# Altium project Enigma Rev A.PrjPCB (part 2 of 10)

## Sheet Snickerdoodle FPGA JA.SchDoc: Snickerdoodle JA
size Tabloid; ApprovedBy: NA; CompanyName: Cospan Design LLC; DrawnBy: Dave McCoy; Engineer: Dave McCoy; DocumentNumber: 4; Revision: A; SheetNumber: 4; SheetTotal: 20; Client: Public; Project: Enigma; ProjectPrettyName: Enigma
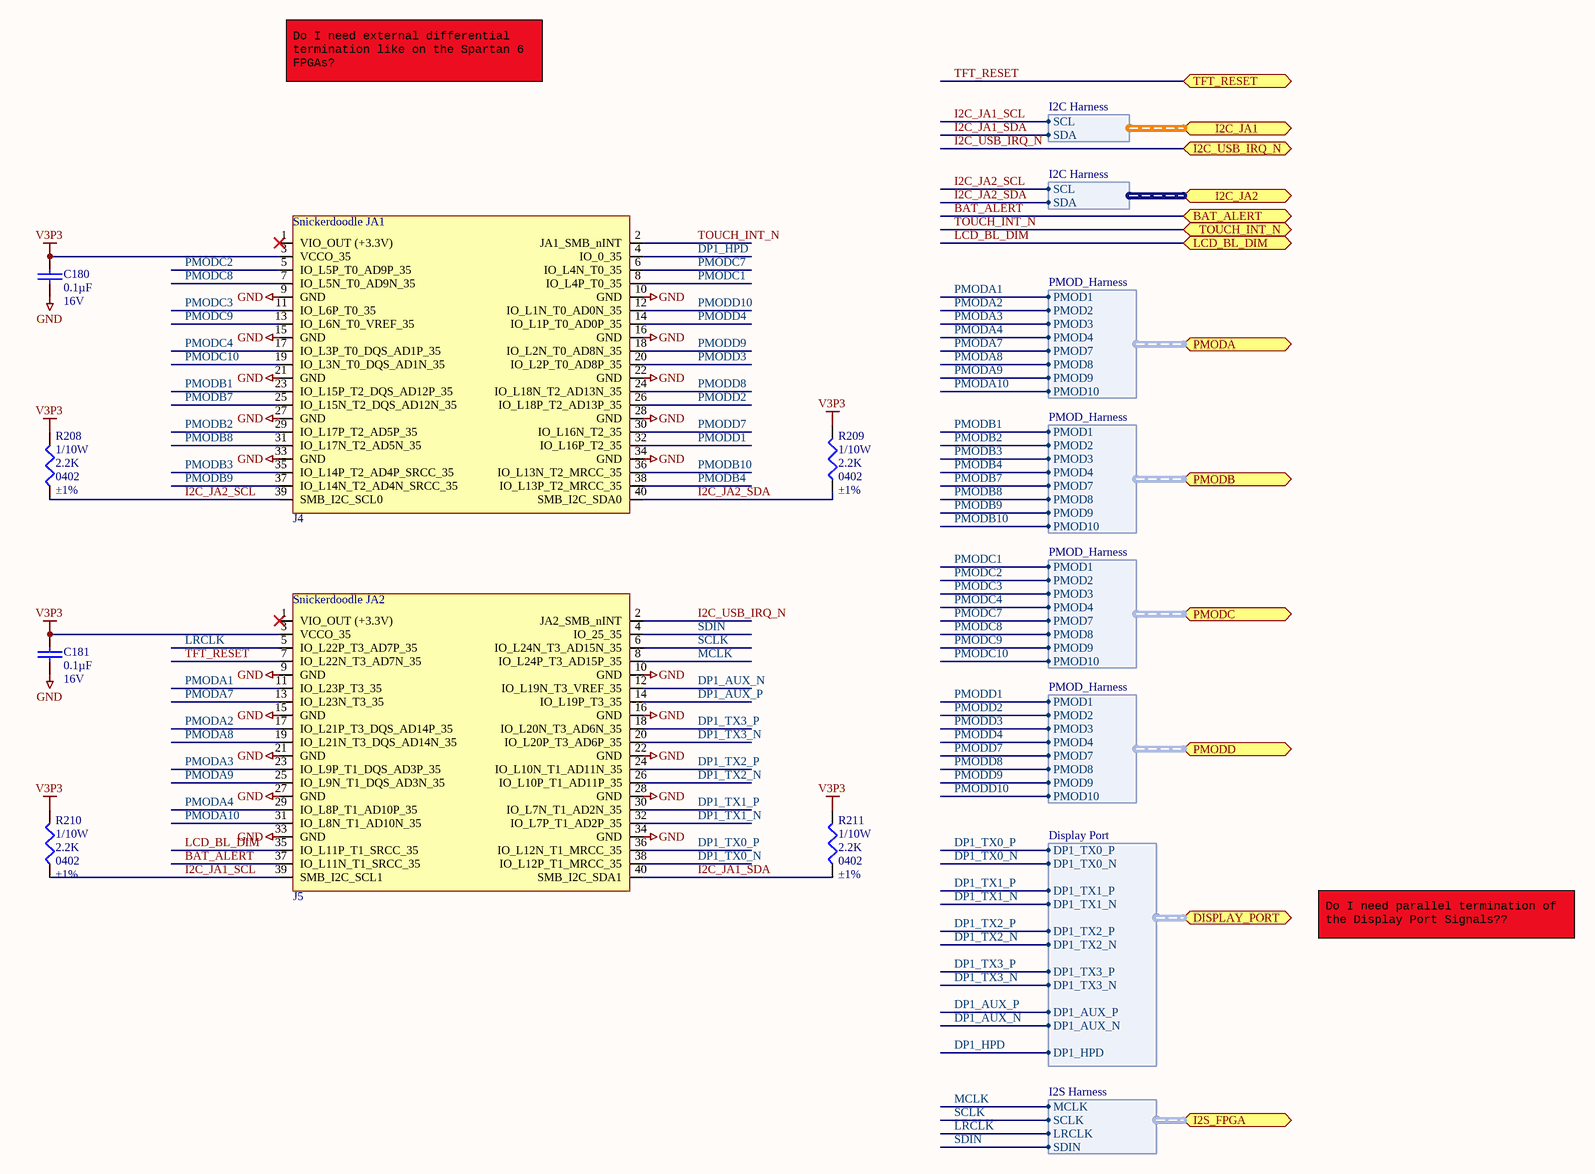
[diagram p5: Snickerdoodle FPGA JA.SchDoc]

### Parts
C180  Capacitance: 0.1µF  Voltage - Rated: 16V  [C_0402]  (hidden comment: 0.1uF)
C181  Capacitance: 0.1µF  Voltage - Rated: 16V  [C_0402]  (hidden comment: 0.1uF)
J4  J_SNICKERDOODLE_JA1  [TFM12001-X-D-A]  (value not drawn)
J5  J_SNICKERDOODLE_JA2  [TFM12001-X-D-A]  (value not drawn)
R208  Power (Watts): 1/10W  Resistance In Ohms: 2.2K  Case: 0402  Tolerance: ±1%  [R_0402]  (hidden comment: 2.2k Ohms)
R209  Power (Watts): 1/10W  Resistance In Ohms: 2.2K  Case: 0402  Tolerance: ±1%  [R_0402]  (hidden comment: 2.2k Ohms)
R210  Power (Watts): 1/10W  Resistance In Ohms: 2.2K  Case: 0402  Tolerance: ±1%  [R_0402]  (hidden comment: 2.2k Ohms)
R211  Power (Watts): 1/10W  Resistance In Ohms: 2.2K  Case: 0402  Tolerance: ±1%  [R_0402]  (hidden comment: 2.2k Ohms)

### Ports
BAT_ALERT, DISPLAY_PORT (harness Display Port), I2C_JA1 (harness I2C Harness), I2C_JA2 (harness I2C Harness), I2C_USB_IRQ_N, I2S_FPGA (harness I2S Harness), LCD_BL_DIM, PMODA (harness PMOD_Harness), PMODB (harness PMOD_Harness), PMODC (harness PMOD_Harness), PMODD (harness PMOD_Harness), TFT_RESET, TOUCH_INT_N

### Harnesses
I2C Harness: SCL, SDA
PMOD_Harness: PMOD1, PMOD2, PMOD3, PMOD4, PMOD7, PMOD8, PMOD9, PMOD10
Display Port: DP1_TX3_P, DP1_TX3_N, DP1_TX2_P, DP1_TX2_N, DP1_TX1_P, DP1_TX1_N, DP1_TX0_P, DP1_TX0_N, DP1_AUX_P, DP1_AUX_N, DP1_HPD
I2S Harness: MCLK, SCLK, LRCLK, SDIN

### Nets
GND: C180.1 C181.1 J4.9(GND) J4.10(GND) J4.15(GND) J4.16(GND) J4.21(GND) J4.22(GND) J4.27(GND) J4.28(GND) J4.33(GND) J4.34(GND) J5.9(GND) J5.10(GND) J5.15(GND) J5.16(GND) J5.21(GND) J5.22(GND) J5.27(GND) J5.28(GND) J5.33(GND) J5.34(GND)
V3P3: C180.2 C181.2 J4.3(VCCO_35) J5.3(VCCO_35) R208.1 R209.1 R210.1 R211.1
BAT_ALERT: J5.37(IO_L11N_T1_SRCC_35) ; port BAT_ALERT  [project net ALERT]
DP1_AUX_N: J5.12(IO_L19N_T3_VREF_35) ; port DISPLAY_PORT.DP1_AUX_N  [project net AUX_N]
DP1_AUX_P: J5.14(IO_L19P_T3_35) ; port DISPLAY_PORT.DP1_AUX_P  [project net AUX_P]
DP1_HPD: J4.4(IO_0_35) ; port DISPLAY_PORT.DP1_HPD  [project net DP_HPD]
DP1_TX0_N: J5.38(IO_L12P_T1_MRCC_35) ; port DISPLAY_PORT.DP1_TX0_N
DP1_TX0_P: J5.36(IO_L12N_T1_MRCC_35) ; port DISPLAY_PORT.DP1_TX0_P
DP1_TX1_N: J5.32(IO_L7P_T1_AD2P_35) ; port DISPLAY_PORT.DP1_TX1_N
DP1_TX1_P: J5.30(IO_L7N_T1_AD2N_35) ; port DISPLAY_PORT.DP1_TX1_P
DP1_TX2_N: J5.26(IO_L10P_T1_AD11P_35) ; port DISPLAY_PORT.DP1_TX2_N
DP1_TX2_P: J5.24(IO_L10N_T1_AD11N_35) ; port DISPLAY_PORT.DP1_TX2_P
DP1_TX3_N: J5.20(IO_L20P_T3_AD6P_35) ; port DISPLAY_PORT.DP1_TX3_N
DP1_TX3_P: J5.18(IO_L20N_T3_AD6N_35) ; port DISPLAY_PORT.DP1_TX3_P
I2C_JA1_SCL: J5.39(SMB_I2C_SCL1) R210.2 ; port I2C_JA1.SCL  [project net I2C_USB_SCL]
I2C_JA1_SDA: J5.40(SMB_I2C_SDA1) R211.2 ; port I2C_JA1.SDA  [project net I2C_USB_SDA]
I2C_JA2_SCL: J4.39(SMB_I2C_SCL0) R208.2 ; port I2C_JA2.SCL  [project net TOUCH_SCL]
I2C_JA2_SDA: J4.40(SMB_I2C_SDA0) R209.2 ; port I2C_JA2.SDA  [project net TOUCH_SDA]
I2C_USB_IRQ_N: J5.2(JA2_SMB_nINT) ; port I2C_USB_IRQ_N
LCD_BL_DIM: J5.35(IO_L11P_T1_SRCC_35) ; port LCD_BL_DIM
LRCLK: J5.5(IO_L22P_T3_AD7P_35) ; port I2S_FPGA.LRCLK
MCLK: J5.8(IO_L24P_T3_AD15P_35) ; port I2S_FPGA.MCLK
PMODA1: J5.11(IO_L23P_T3_35) ; port PMODA.PMOD1
PMODA2: J5.17(IO_L21P_T3_DQS_AD14P_35) ; port PMODA.PMOD2
PMODA3: J5.23(IO_L9P_T1_DQS_AD3P_35) ; port PMODA.PMOD3
PMODA4: J5.29(IO_L8P_T1_AD10P_35) ; port PMODA.PMOD4
PMODA7: J5.13(IO_L23N_T3_35) ; port PMODA.PMOD7
PMODA8: J5.19(IO_L21N_T3_DQS_AD14N_35) ; port PMODA.PMOD8
PMODA9: J5.25(IO_L9N_T1_DQS_AD3N_35) ; port PMODA.PMOD9
PMODA10: J5.31(IO_L8N_T1_AD10N_35) ; port PMODA.PMOD10
PMODB1: J4.23(IO_L15P_T2_DQS_AD12P_35) ; port PMODB.PMOD1
PMODB2: J4.29(IO_L17P_T2_AD5P_35) ; port PMODB.PMOD2
PMODB3: J4.35(IO_L14P_T2_AD4P_SRCC_35) ; port PMODB.PMOD3
PMODB4: J4.38(IO_L13P_T2_MRCC_35) ; port PMODB.PMOD4
PMODB7: J4.25(IO_L15N_T2_DQS_AD12N_35) ; port PMODB.PMOD7
PMODB8: J4.31(IO_L17N_T2_AD5N_35) ; port PMODB.PMOD8
PMODB9: J4.37(IO_L14N_T2_AD4N_SRCC_35) ; port PMODB.PMOD9
PMODB10: J4.36(IO_L13N_T2_MRCC_35) ; port PMODB.PMOD10
PMODC1: J4.8(IO_L4P_T0_35) ; port PMODC.PMOD1
PMODC2: J4.5(IO_L5P_T0_AD9P_35) ; port PMODC.PMOD2
PMODC3: J4.11(IO_L6P_T0_35) ; port PMODC.PMOD3
PMODC4: J4.17(IO_L3P_T0_DQS_AD1P_35) ; port PMODC.PMOD4
PMODC7: J4.6(IO_L4N_T0_35) ; port PMODC.PMOD7
PMODC8: J4.7(IO_L5N_T0_AD9N_35) ; port PMODC.PMOD8
PMODC9: J4.13(IO_L6N_T0_VREF_35) ; port PMODC.PMOD9
PMODC10: J4.19(IO_L3N_T0_DQS_AD1N_35) ; port PMODC.PMOD10
PMODD1: J4.32(IO_L16P_T2_35) ; port PMODD.PMOD1
PMODD2: J4.26(IO_L18P_T2_AD13P_35) ; port PMODD.PMOD2
PMODD3: J4.20(IO_L2P_T0_AD8P_35) ; port PMODD.PMOD3
PMODD4: J4.14(IO_L1P_T0_AD0P_35) ; port PMODD.PMOD4
PMODD7: J4.30(IO_L16N_T2_35) ; port PMODD.PMOD7
PMODD8: J4.24(IO_L18N_T2_AD13N_35) ; port PMODD.PMOD8
PMODD9: J4.18(IO_L2N_T0_AD8N_35) ; port PMODD.PMOD9
PMODD10: J4.12(IO_L1N_T0_AD0N_35) ; port PMODD.PMOD10
SCLK: J5.6(IO_L24N_T3_AD15N_35) ; port I2S_FPGA.SCLK
SDIN: J5.4(IO_25_35) ; port I2S_FPGA.SDIN
TFT_RESET: J5.7(IO_L22N_T3_AD7N_35) ; port TFT_RESET
TOUCH_INT_N: J4.2(JA1_SMB_nINT) ; port TOUCH_INT_N

Not connected (* = marked no-connect by the designer): J4 1(VIO_OUT_(+3.3V))*; J5 1(VIO_OUT_(+3.3V))*

### Notes on the sheet
- Do I need external differential termination like on the Spartan 6 FPGAs?
- Do I need parallel termination of the Display Port Signals??
- Project:
- http://www.cospandesign.com
- Cospan Design
- Document:
- Engineer:
- Title:
- Client:
- Approved By:
- Revision:
- Date:
- Number:
- of
- (in symbol J_SNICKERDOODLE_JA1) Snickerdoodle JA1
- (in symbol J_SNICKERDOODLE_JA2) Snickerdoodle JA2

### Library data of the parts
C180 C181 = C_0402_0.1UF_16V: CAP CER .10UF 16V X7R 0402; Manufacturer: TDK Corporation; Manufacturer Part Number: C1005X7R1C104K050BC; Tolerance: ±10%; Supplier 1: Digi-Key; RoHS: RoHS Compliant; Category: Capacitors; Stock 1: 2696686; Pricing 1: 1=0.1, 10=0.05, 100=0.0231, 250=0.01892, 500=0.01618, 1000=0.0126, 5000=0.0105 (USD); Packaging: Cut Tape (CT); Part Status: Not For New Designs; Operating Temperature: -55°C ~ 125°C; Features: Low ESL; Ratings: -; Applications: General Purpose; Failure Rate: -; Mounting Type: Surface Mount, MLCC; Size / Dimension: 0.039" L x 0.020" W (1.00mm x 0.50mm); Height - Seated (Max): -; Thickness (Max): 0.022" (0.55mm); Lead Spacing: -; Lead Style: -; ComponentLink1URL: https://product.tdk.com/info/en/catalog/datasheets/mlcc_commercial_general_en.pdf; ComponentLink1Description: https://product.tdk.com/info/en/catalog/datasheets/mlcc_commercial_general_en.pdf; Supplier Part Number 1: 445-4952-1-ND; Temperature Coefficient: X7R; Package / Case: 0402
R208-R211 = R_0402_2.2K: as R219 on sheet Snickerdoodle PS; Supplier 1: Digi-Key; Supplier Part Number 1: 311-2.20KLRCT-ND; RoHS: RoHS Compliant; Category: Resistors; Stock 1: 0; Pricing: 10=0.014, 100=0.0063, 500=0.00382, 1000=0.0027, 5000=0.00203 (USD); Resistance (Ohms): 2.2K; Composition: Thick Film; Features: -; Package / Case: 0402 (1005 Metric); Size / Dimension: 0.039" L x 0.020" W (1.00mm x 0.50mm); Height: 0.016" (0.40mm); Number of Terminations: 2; Packaging: Cut Tape (CT); ComponentLink1URL: http://www.yageo.com/documents/recent/PYu-RC0402_51_RoHS_L_6.pdf; ComponentLink1Description: http://www.yageo.com/documents/recent/PYu-RC0402_51_RoHS_L_6.pdf; Supplier 2: Digi-Key; Supplier Part Number 2: RMCF0402FT2K20CT-ND; Stock 2: 39712; ComponentLink2URL: http://www.seielect.com/Catalog/SEI-RMCF_RMCP.pdf; ComponentLink2Description: http://www.seielect.com/Catalog/SEI-RMCF_RMCP.pdf

## Sheet Snickerdoodle FPGA JB.SchDoc: Snickerdoodle JB
size Tabloid; ApprovedBy: NA; CompanyName: Cospan Design LLC; DrawnBy: Dave McCoy; Engineer: Dave McCoy; DocumentNumber: 5; Revision: A; SheetNumber: 5; SheetTotal: 20; Client: Public; Project: Enigma; ProjectPrettyName: Enigma
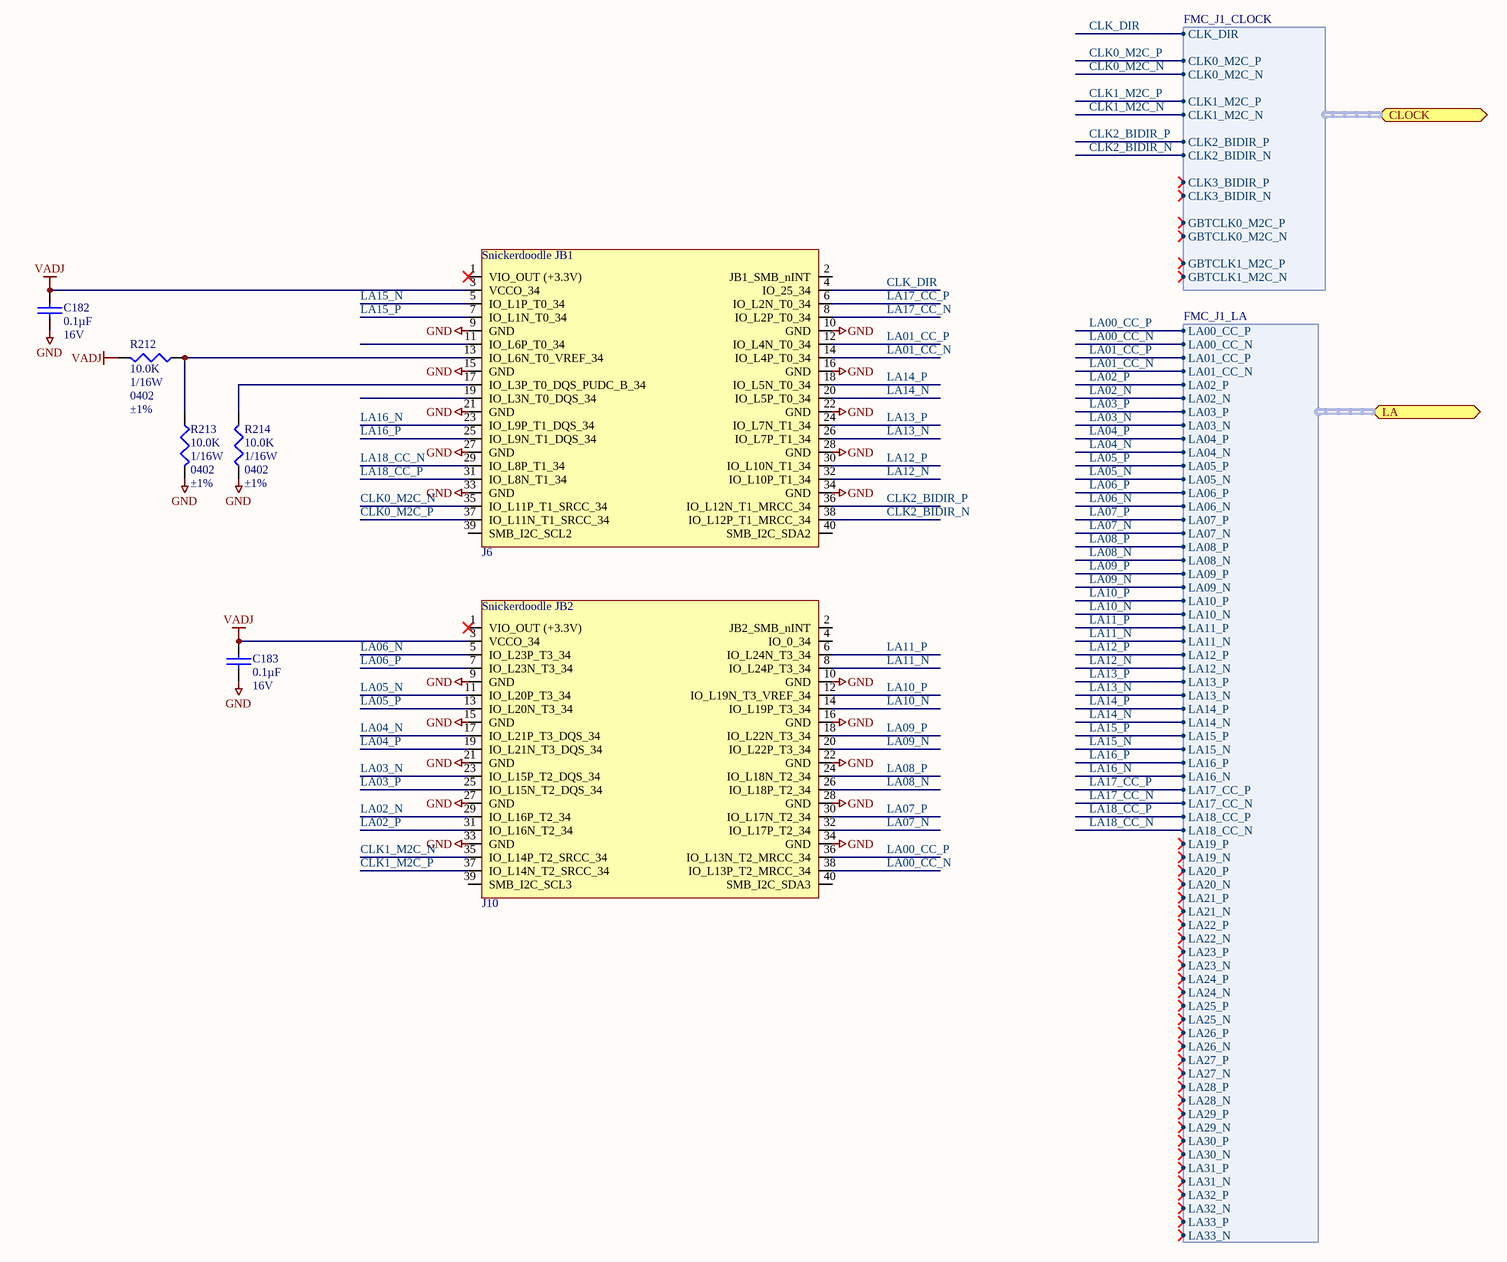
[diagram p6: Snickerdoodle FPGA JB.SchDoc]

### Parts
C182  Capacitance: 0.1µF  Voltage - Rated: 16V  [C_0402]  (hidden comment: 0.1uF)
C183  Capacitance: 0.1µF  Voltage - Rated: 16V  [C_0402]  (hidden comment: 0.1uF)
J6  J_SNICKERDOODLE_JB1  [TFM12001-X-D-A]  (value not drawn)
J10  J_SNICKERDOODLE_JB2  [TFM12001-X-D-A]  (value not drawn)
R212  Resistance In Ohms: 10.0K  Power (Watts): 1/16W  Case: 0402  Tolerance: ±1%  [R_0402]  (hidden comment: R_0402_10.0K)
R213  Resistance In Ohms: 10.0K  Power (Watts): 1/16W  Case: 0402  Tolerance: ±1%  [R_0402]  (hidden comment: R_0402_10.0K)
R214  Resistance In Ohms: 10.0K  Power (Watts): 1/16W  Case: 0402  Tolerance: ±1%  [R_0402]  (hidden comment: R_0402_10.0K)

### Ports
CLOCK (harness FMC_J1_CLOCK), LA (harness FMC_J1_LA)

### Harnesses
FMC_J1_CLOCK: CLK_DIR, CLK0_M2C_N, CLK0_M2C_P, CLK1_M2C_N, CLK1_M2C_P, CLK2_BIDIR_N, CLK2_BIDIR_P, CLK3_BIDIR_N, CLK3_BIDIR_P, GBTCLK0_M2C_N, GBTCLK0_M2C_P, GBTCLK1_M2C_N, GBTCLK1_M2C_P
FMC_J1_LA: LA00_CC_N, LA00_CC_P, LA01_CC_N, LA01_CC_P, LA02_N, LA02_P, LA03_N, LA03_P, LA04_N, LA04_P, LA05_N, LA05_P, LA06_N, LA06_P, LA07_N, LA07_P, LA08_N, LA08_P, LA09_N, LA09_P, LA10_N, LA10_P, LA11_N, LA11_P, LA12_N, LA12_P, LA13_N, LA13_P, LA14_N, LA14_P, LA15_N, LA15_P, LA16_N, LA16_P, LA17_CC_N, LA17_CC_P, LA18_CC_N, LA18_CC_P, LA19_N, LA19_P, LA20_N, LA20_P, LA21_N, LA21_P, LA22_N, LA22_P, LA23_N, LA23_P, LA24_N, LA24_P, LA25_N, LA25_P, LA26_N, LA26_P, LA27_N, LA27_P, LA28_N, LA28_P, LA29_N, LA29_P, LA30_N, LA30_P, LA31_N, LA31_P, LA32_N, LA32_P, LA33_N, LA33_P

### Nets
GND: C182.1 C183.1 J6.9(GND) J6.10(GND) J6.15(GND) J6.16(GND) J6.21(GND) J6.22(GND) J6.27(GND) J6.28(GND) J6.33(GND) J6.34(GND) J10.9(GND) J10.10(GND) J10.15(GND) J10.16(GND) J10.21(GND) J10.22(GND) J10.27(GND) J10.28(GND) J10.33(GND) J10.34(GND) R213.1 R214.2
VADJ: C182.2 C183.2 J6.3(VCCO_34) J10.3(VCCO_34) R212.1
CLK0_M2C_N: J6.35(IO_L11P_T1_SRCC_34) ; port CLOCK.CLK0_M2C_N
CLK0_M2C_P: J6.37(IO_L11N_T1_SRCC_34) ; port CLOCK.CLK0_M2C_P
CLK1_M2C_N: J10.35(IO_L14P_T2_SRCC_34) ; port CLOCK.CLK1_M2C_N
CLK1_M2C_P: J10.37(IO_L14N_T2_SRCC_34) ; port CLOCK.CLK1_M2C_P
CLK2_BIDIR_N: J6.38(IO_L12P_T1_MRCC_34) ; port CLOCK.CLK2_BIDIR_N
CLK2_BIDIR_P: J6.36(IO_L12N_T1_MRCC_34) ; port CLOCK.CLK2_BIDIR_P
CLK_DIR: J6.4(IO_25_34) ; port CLOCK.CLK_DIR
LA00_CC_N: J10.38(IO_L13P_T2_MRCC_34) ; port LA.LA00_CC_N
LA00_CC_P: J10.36(IO_L13N_T2_MRCC_34) ; port LA.LA00_CC_P
LA01_CC_N: J6.14(IO_L4P_T0_34) ; port LA.LA01_CC_N
LA01_CC_P: J6.12(IO_L4N_T0_34) ; port LA.LA01_CC_P
LA02_N: J10.29(IO_L16P_T2_34) ; port LA.LA02_N
LA02_P: J10.31(IO_L16N_T2_34) ; port LA.LA02_P
LA03_N: J10.23(IO_L15P_T2_DQS_34) ; port LA.LA03_N
LA03_P: J10.25(IO_L15N_T2_DQS_34) ; port LA.LA03_P
LA04_N: J10.17(IO_L21P_T3_DQS_34) ; port LA.LA04_N
LA04_P: J10.19(IO_L21N_T3_DQS_34) ; port LA.LA04_P
LA05_N: J10.11(IO_L20P_T3_34) ; port LA.LA05_N
LA05_P: J10.13(IO_L20N_T3_34) ; port LA.LA05_P
LA06_N: J10.5(IO_L23P_T3_34) ; port LA.LA06_N
LA06_P: J10.7(IO_L23N_T3_34) ; port LA.LA06_P
LA07_N: J10.32(IO_L17P_T2_34) ; port LA.LA07_N
LA07_P: J10.30(IO_L17N_T2_34) ; port LA.LA07_P
LA08_N: J10.26(IO_L18P_T2_34) ; port LA.LA08_N
LA08_P: J10.24(IO_L18N_T2_34) ; port LA.LA08_P
LA09_N: J10.20(IO_L22P_T3_34) ; port LA.LA09_N
LA09_P: J10.18(IO_L22N_T3_34) ; port LA.LA09_P
LA10_N: J10.14(IO_L19P_T3_34) ; port LA.LA10_N
LA10_P: J10.12(IO_L19N_T3_VREF_34) ; port LA.LA10_P
LA11_N: J10.8(IO_L24P_T3_34) ; port LA.LA11_N
LA11_P: J10.6(IO_L24N_T3_34) ; port LA.LA11_P
LA12_N: J6.32(IO_L10P_T1_34) ; port LA.LA12_N
LA12_P: J6.30(IO_L10N_T1_34) ; port LA.LA12_P
LA13_N: J6.26(IO_L7P_T1_34) ; port LA.LA13_N
LA13_P: J6.24(IO_L7N_T1_34) ; port LA.LA13_P
LA14_N: J6.20(IO_L5P_T0_34) ; port LA.LA14_N
LA14_P: J6.18(IO_L5N_T0_34) ; port LA.LA14_P
LA15_N: J6.5(IO_L1P_T0_34) ; port LA.LA15_N
LA15_P: J6.7(IO_L1N_T0_34) ; port LA.LA15_P
LA16_N: J6.23(IO_L9P_T1_DQS_34) ; port LA.LA16_N
LA16_P: J6.25(IO_L9N_T1_DQS_34) ; port LA.LA16_P
LA17_CC_N: J6.8(IO_L2P_T0_34) ; port LA.LA17_CC_N
LA17_CC_P: J6.6(IO_L2N_T0_34) ; port LA.LA17_CC_P
LA18_CC_N: J6.29(IO_L8P_T1_34) ; port LA.LA18_CC_N
LA18_CC_P: J6.31(IO_L8N_T1_34) ; port LA.LA18_CC_P
NetJ6_13: J6.13(IO_L6N_T0_VREF_34) R212.2 R213.2
NetJ6_17: J6.17(IO_L3P_T0_DQS_PUDC_B_34) R214.1

Not connected (* = marked no-connect by the designer): J6 1(VIO_OUT_(+3.3V))* 2(JB1_SMB_nINT) 11(IO_L6P_T0_34) 19(IO_L3N_T0_DQS_34) 39(SMB_I2C_SCL2) 40(SMB_I2C_SDA2); J10 1(VIO_OUT_(+3.3V))* 2(JB2_SMB_nINT) 4(IO_0_34) 39(SMB_I2C_SCL3) 40(SMB_I2C_SDA3)

### Notes on the sheet
- Project:
- http://www.cospandesign.com
- Cospan Design
- Document:
- Engineer:
- Title:
- Client:
- Approved By:
- Revision:
- Date:
- Number:
- of
- (in symbol J_SNICKERDOODLE_JB1) Snickerdoodle JB1
- (in symbol J_SNICKERDOODLE_JB2) Snickerdoodle JB2

### Library data of the parts
C182 C183 = C_0402_0.1UF_16V: as C180 on sheet Snickerdoodle FPGA JA; Supplier 1: Digi-Key; RoHS: RoHS Compliant; Category: Capacitors; Stock 1: 2696686; Pricing 1: 1=0.1, 10=0.05, 100=0.0231, 250=0.01892, 500=0.01618, 1000=0.0126, 5000=0.0105 (USD); Packaging: Cut Tape (CT); Part Status: Not For New Designs; Operating Temperature: -55°C ~ 125°C; Features: Low ESL; Ratings: -; Applications: General Purpose; Failure Rate: -; Mounting Type: Surface Mount, MLCC; Size / Dimension: 0.039" L x 0.020" W (1.00mm x 0.50mm); Height - Seated (Max): -; Thickness (Max): 0.022" (0.55mm); Lead Spacing: -; Lead Style: -; ComponentLink1URL: https://product.tdk.com/info/en/catalog/datasheets/mlcc_commercial_general_en.pdf; ComponentLink1Description: https://product.tdk.com/info/en/catalog/datasheets/mlcc_commercial_general_en.pdf; Supplier Part Number 1: 445-4952-1-ND; Temperature Coefficient: X7R; Package / Case: 0402
R212-R214 = R_0402_10.0K: as R1 on sheet Block Diagram; Supplier 1: Digi-Key; Supplier Part Number 1: RMCF0402FT10K0CT-ND; RoHS: RoHS Compliant; Category: Resistors; Stock 1: 234525; Pricing: 1=0.04, 10=0.025, 50=0.0138, 100=0.0105, 250=0.0078, 500=0.00576, 1000=0.00384, 2500=0.00324, 5000=0.0027 (USD); Composition: Thick Film; Features: -; Package / Case: 0402 (1005 Metric); Size / Dimension: 0.039" L x 0.020" W (1.00mm x 0.50mm); Height: 0.016" (0.40mm); Number of Terminations: 2; Packaging: Cut Tape (CT); ComponentLink1URL: http://www.seielect.com/Catalog/SEI-RMCF_RMCP.pdf; ComponentLink1Description: http://www.seielect.com/Catalog/SEI-RMCF_RMCP.pdf

## Sheet Snickerdoodle FPGA JC.SchDoc: Snickerdoodle JC
size Tabloid; ApprovedBy: NA; CompanyName: Cospan Design LLC; DrawnBy: Dave McCoy; Engineer: Dave McCoy; DocumentNumber: 7; Revision: A; SheetNumber: 7; SheetTotal: 20; Client: Public; Project: Enigma; ProjectPrettyName: Enigma
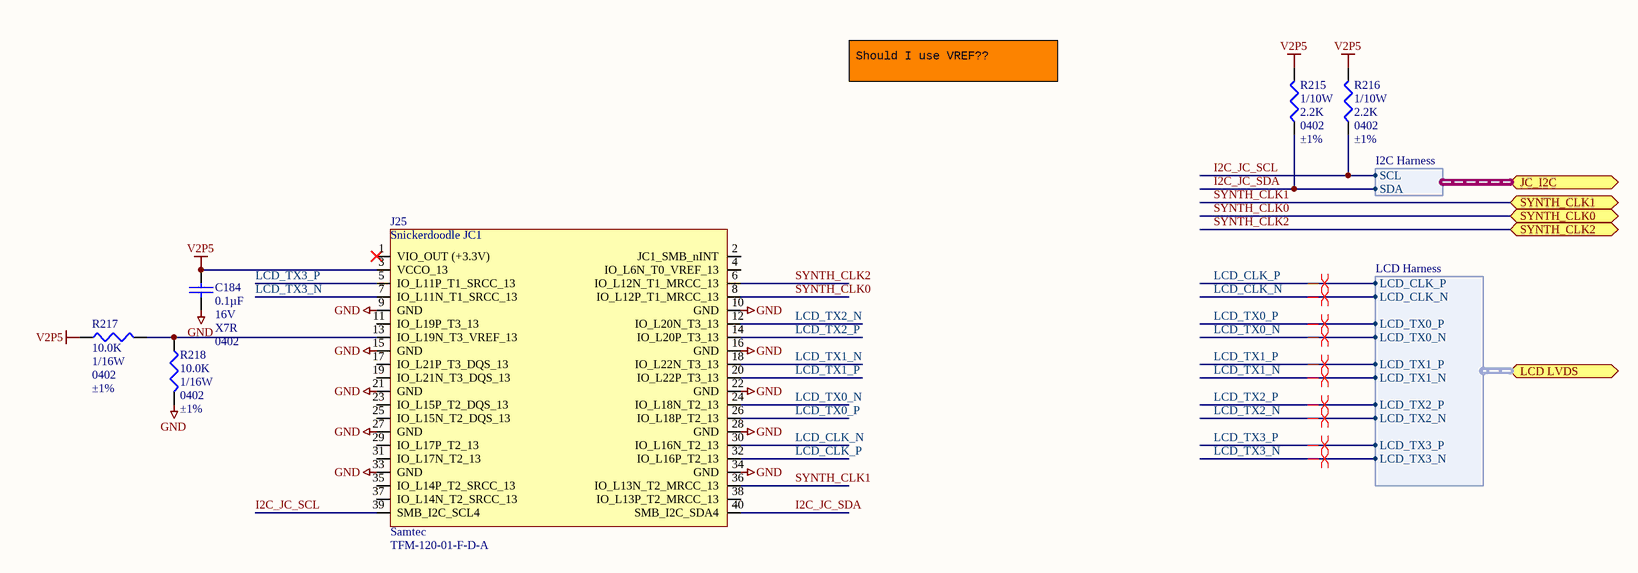
[diagram p7: Snickerdoodle FPGA JC.SchDoc]

### Parts
C184  Capacitance: 0.1µF  Voltage - Rated: 16V  Temperature Coefficient: X7R  Package / Case: 0402  [C_0402]  (hidden comment: 0.1uF)
J25  Manufacturer: Samtec  Manufacturer Part Number: TFM-120-01-F-D-A  [TFM12001-X-D-A]  (hidden comment: J_SNICKERDOODLE_JC1)
R215  Power (Watts): 1/10W  Resistance In Ohms: 2.2K  Case: 0402  Tolerance: ±1%  [R_0402]  (hidden comment: 2.2k Ohms)
R216  Power (Watts): 1/10W  Resistance In Ohms: 2.2K  Case: 0402  Tolerance: ±1%  [R_0402]  (hidden comment: 2.2k Ohms)
R217  Resistance In Ohms: 10.0K  Power (Watts): 1/16W  Case: 0402  Tolerance: ±1%  [R_0402]  (hidden comment: R_0402_10.0K)
R218  Resistance In Ohms: 10.0K  Power (Watts): 1/16W  Case: 0402  Tolerance: ±1%  [R_0402]  (hidden comment: R_0402_10.0K)

### Ports
JC_I2C (harness I2C Harness), LCD LVDS (harness LCD Harness), SYNTH_CLK0, SYNTH_CLK1, SYNTH_CLK2

### Harnesses
I2C Harness: SCL, SDA
LCD Harness: LCD_CLK_P, LCD_CLK_N, LCD_TX0_P, LCD_TX0_N, LCD_TX1_P, LCD_TX1_N, LCD_TX2_P, LCD_TX2_N, LCD_TX3_P, LCD_TX3_N

### Nets
GND: C184.1 J25.9(GND) J25.10(GND) J25.15(GND) J25.16(GND) J25.21(GND) J25.22(GND) J25.27(GND) J25.28(GND) J25.33(GND) J25.34(GND) R218.1
V2P5: C184.2 J25.3(VCCO_13) R215.1 R216.1 R217.2
I2C_JC_SCL: J25.39(SMB_I2C_SCL4) R216.2 ; port JC_I2C.SCL
I2C_JC_SDA: J25.40(SMB_I2C_SDA4) R215.2 ; port JC_I2C.SDA
LCD_CLK_N: J25.30(IO_L16N_T2_13) ; port LCD LVDS.LCD_CLK_N
LCD_CLK_P: J25.32(IO_L16P_T2_13) ; port LCD LVDS.LCD_CLK_P
LCD_TX0_N: J25.24(IO_L18N_T2_13) ; port LCD LVDS.LCD_TX0_N
LCD_TX0_P: J25.26(IO_L18P_T2_13) ; port LCD LVDS.LCD_TX0_P
LCD_TX1_N: J25.18(IO_L22N_T3_13) ; port LCD LVDS.LCD_TX1_N
LCD_TX1_P: J25.20(IO_L22P_T3_13) ; port LCD LVDS.LCD_TX1_P
LCD_TX2_N: J25.12(IO_L20N_T3_13) ; port LCD LVDS.LCD_TX2_N
LCD_TX2_P: J25.14(IO_L20P_T3_13) ; port LCD LVDS.LCD_TX2_P
LCD_TX3_N: J25.7(IO_L11N_T1_SRCC_13) ; port LCD LVDS.LCD_TX3_N
LCD_TX3_P: J25.5(IO_L11P_T1_SRCC_13) ; port LCD LVDS.LCD_TX3_P
SYNTH_CLK0: J25.8(IO_L12P_T1_MRCC_13) ; port SYNTH_CLK0
SYNTH_CLK1: J25.36(IO_L13N_T2_MRCC_13) ; port SYNTH_CLK1
SYNTH_CLK2: J25.6(IO_L12N_T1_MRCC_13) ; port SYNTH_CLK2
NetJ25_13: J25.13(IO_L19N_T3_VREF_13) R217.1 R218.2

Not connected (* = marked no-connect by the designer): J25 1(VIO_OUT_(+3.3V))* 2(JC1_SMB_nINT) 4(IO_L6N_T0_VREF_13) 11(IO_L19P_T3_13) 17(IO_L21P_T3_DQS_13) 19(IO_L21N_T3_DQS_13) 23(IO_L15P_T2_DQS_13) 25(IO_L15N_T2_DQS_13) 29(IO_L17P_T2_13) 31(IO_L17N_T2_13) 35(IO_L14P_T2_SRCC_13) 37(IO_L14N_T2_SRCC_13) 38(IO_L13P_T2_MRCC_13)

### Layout directives
differential pair: LCD_CLK_N, LCD_CLK_P, LCD_TX0_N, LCD_TX0_P, LCD_TX1_N, LCD_TX1_P, LCD_TX2_N, LCD_TX2_P, LCD_TX3_N, LCD_TX3_P

### Notes on the sheet
- Should I use VREF??
- Project:
- http://www.cospandesign.com
- Cospan Design
- Document:
- Engineer:
- Title:
- Client:
- Approved By:
- Revision:
- Date:
- Number:
- of
- (in symbol J_SNICKERDOODLE_JC1) Snickerdoodle JC1

### Library data of the parts
C184 = C_0402_0.1UF_16V: as C1 on sheet Arduino and PMOD Connectors; Supplier 1: Digi-Key; RoHS: RoHS Compliant; Category: Capacitors; Stock 1: 18103134; Pricing 1: 1=0.1, 10=0.014, 100=0.0062, 500=0.00442, 1000=0.00348, 2500=0.00316, 5000=0.00291 (USD); Packaging: Cut Tape (CT); Part Status: Active; Operating Temperature: -55°C ~ 125°C; Features: -; Ratings: -; Applications: General Purpose; Mounting Type: Surface Mount, MLCC; Size / Dimension: 0.039" L x 0.020" W (1.00mm x 0.50mm); Height - Seated (Max): -; Thickness (Max): 0.022" (0.55mm); Lead Spacing: -; ComponentLink1URL: http://www.murata.com/~/media/webrenewal/support/library/catalog/products/capacitor/mlcc/c02e.ashx?la=en-us; ComponentLink1Description: http://www.murata.com/~/media/webrenewal/support/library/catalog/products/capacitor/mlcc/c02e.ashx?la=en-us; Supplier Part Number 1: 490-6328-1-ND
J25 = J_SNICKERDOODLE_JC1: SNICKERDOODLE JC1
R215 R216 = R_0402_2.2K: as R219 on sheet Snickerdoodle PS; Supplier 1: Digi-Key; Supplier Part Number 1: 311-2.20KLRCT-ND; RoHS: RoHS Compliant; Category: Resistors; Stock 1: 0; Pricing: 10=0.014, 100=0.0063, 500=0.00382, 1000=0.0027, 5000=0.00203 (USD); Resistance (Ohms): 2.2K; Composition: Thick Film; Features: -; Package / Case: 0402 (1005 Metric); Size / Dimension: 0.039" L x 0.020" W (1.00mm x 0.50mm); Height: 0.016" (0.40mm); Number of Terminations: 2; Packaging: Cut Tape (CT); ComponentLink1URL: http://www.yageo.com/documents/recent/PYu-RC0402_51_RoHS_L_6.pdf; ComponentLink1Description: http://www.yageo.com/documents/recent/PYu-RC0402_51_RoHS_L_6.pdf; Supplier 2: Digi-Key; Supplier Part Number 2: RMCF0402FT2K20CT-ND; Stock 2: 39712; ComponentLink2URL: http://www.seielect.com/Catalog/SEI-RMCF_RMCP.pdf; ComponentLink2Description: http://www.seielect.com/Catalog/SEI-RMCF_RMCP.pdf
R217 R218 = R_0402_10.0K: as R1 on sheet Block Diagram; Supplier 1: Digi-Key; Supplier Part Number 1: RMCF0402FT10K0CT-ND; RoHS: RoHS Compliant; Category: Resistors; Stock 1: 234525; Pricing: 1=0.04, 10=0.025, 50=0.0138, 100=0.0105, 250=0.0078, 500=0.00576, 1000=0.00384, 2500=0.00324, 5000=0.0027 (USD); Composition: Thick Film; Features: -; Package / Case: 0402 (1005 Metric); Size / Dimension: 0.039" L x 0.020" W (1.00mm x 0.50mm); Height: 0.016" (0.40mm); Number of Terminations: 2; Packaging: Cut Tape (CT); ComponentLink1URL: http://www.seielect.com/Catalog/SEI-RMCF_RMCP.pdf; ComponentLink1Description: http://www.seielect.com/Catalog/SEI-RMCF_RMCP.pdf